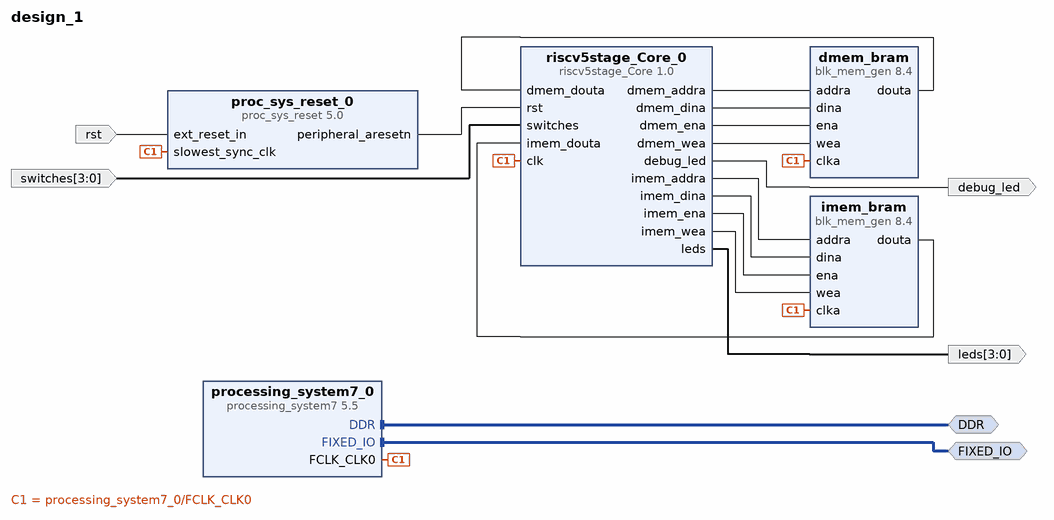
[diagram p0: block diagram of the top level]
# Vivado block design design_1, xc7z020clg400-1, Vivado 2025.1
create_bd_design design_1

create_bd_intf_port -mode Master -vlnv xilinx.com:interface:ddrx_rtl:1.0 DDR
create_bd_intf_port -mode Master -vlnv xilinx.com:display_processing_system7:fixedio_rtl:1.0 FIXED_IO
create_bd_port -dir O -from 3 -to 0 leds
create_bd_port -dir O debug_led
create_bd_port -dir I -from 3 -to 0 switches
create_bd_port -dir I -type rst rst

create_bd_cell -type ip -vlnv xilinx.com:ip:processing_system7:5.5 processing_system7_0
set_property -dict {CONFIG.PCW_USE_M_AXI_GP0 0} [get_bd_cells processing_system7_0]
# 1 more settings of processing_system7_0 are not shown: defaults, MIO pin electricals, DDR timing, and values the tool derives
create_bd_cell -type ip -vlnv xilinx.com:ip:blk_mem_gen:8.4 imem_bram
set_property -dict [list \
  CONFIG.Byte_Size 8 \
  CONFIG.Coe_File ../../../../../../imem.coe \
  CONFIG.Load_Init_File true \
  CONFIG.Use_Byte_Write_Enable true \
  CONFIG.Write_Depth_A 1024 \
  CONFIG.Write_Width_A 32 \
  CONFIG.use_bram_block Stand_Alone \
] [get_bd_cells imem_bram]
create_bd_cell -type ip -vlnv xilinx.com:ip:blk_mem_gen:8.4 dmem_bram
set_property -dict [list \
  CONFIG.Byte_Size 8 \
  CONFIG.Use_Byte_Write_Enable true \
  CONFIG.Write_Depth_A 1024 \
  CONFIG.Write_Width_A 32 \
  CONFIG.use_bram_block Stand_Alone \
] [get_bd_cells dmem_bram]
create_bd_cell -type ip -vlnv xilinx.com:ip:proc_sys_reset:5.0 proc_sys_reset_0
create_bd_cell -type ip -vlnv xilinx.com:user:riscv5stage_Core:1.0 riscv5stage_Core_0

# ---- connections ----

connect_bd_intf_net [get_bd_intf_ports DDR] [get_bd_intf_pins processing_system7_0/DDR]
connect_bd_intf_net [get_bd_intf_ports FIXED_IO] [get_bd_intf_pins processing_system7_0/FIXED_IO]
connect_bd_net [get_bd_pins dmem_bram/douta] [get_bd_pins riscv5stage_Core_0/dmem_douta]
connect_bd_net -net ext_reset_in_0_1 [get_bd_ports rst] [get_bd_pins proc_sys_reset_0/ext_reset_in]
connect_bd_net [get_bd_pins imem_bram/douta] [get_bd_pins riscv5stage_Core_0/imem_douta]
connect_bd_net [get_bd_pins proc_sys_reset_0/peripheral_aresetn] [get_bd_pins riscv5stage_Core_0/rst]
connect_bd_net [get_bd_pins processing_system7_0/FCLK_CLK0] \
  [get_bd_pins proc_sys_reset_0/slowest_sync_clk] [get_bd_pins dmem_bram/clka] [get_bd_pins imem_bram/clka] \
  [get_bd_pins riscv5stage_Core_0/clk]
connect_bd_net [get_bd_pins riscv5stage_Core_0/debug_led] [get_bd_ports debug_led]
connect_bd_net [get_bd_pins riscv5stage_Core_0/dmem_addra] [get_bd_pins dmem_bram/addra]
connect_bd_net [get_bd_pins riscv5stage_Core_0/dmem_dina] [get_bd_pins dmem_bram/dina]
connect_bd_net [get_bd_pins riscv5stage_Core_0/dmem_ena] [get_bd_pins dmem_bram/ena]
connect_bd_net [get_bd_pins riscv5stage_Core_0/dmem_wea] [get_bd_pins dmem_bram/wea]
connect_bd_net [get_bd_pins riscv5stage_Core_0/imem_addra] [get_bd_pins imem_bram/addra]
connect_bd_net [get_bd_pins riscv5stage_Core_0/imem_dina] [get_bd_pins imem_bram/dina]
connect_bd_net [get_bd_pins riscv5stage_Core_0/imem_ena] [get_bd_pins imem_bram/ena]
connect_bd_net [get_bd_pins riscv5stage_Core_0/imem_wea] [get_bd_pins imem_bram/wea]
connect_bd_net [get_bd_pins riscv5stage_Core_0/leds] [get_bd_ports leds]
connect_bd_net [get_bd_ports switches] [get_bd_pins riscv5stage_Core_0/switches]

validate_bd_design
save_bd_design
